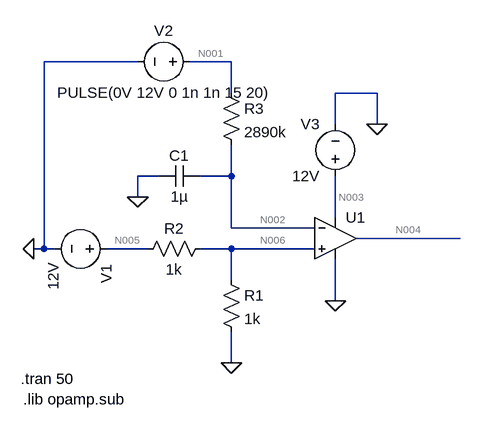
[diagram p0: schematic Timer.asc]
Timer.asc, the LTspice schematic file:
Version 4
SHEET 1 880 680
WIRE 160 -208 16 -208
WIRE 304 -208 240 -208
WIRE 304 -160 304 -208
WIRE 528 -160 464 -160
WIRE 464 -112 464 -160
WIRE 528 -112 528 -160
WIRE 192 -32 160 -32
WIRE 304 -32 304 -80
WIRE 304 -32 256 -32
WIRE 160 0 160 -32
WIRE 464 32 464 -32
WIRE 304 48 304 -32
WIRE 432 48 304 48
WIRE 656 64 496 64
WIRE 16 80 16 -208
WIRE 16 80 0 80
WIRE 32 80 16 80
WIRE 176 80 112 80
WIRE 304 80 256 80
WIRE 432 80 304 80
WIRE 304 128 304 80
WIRE 464 160 464 96
WIRE 304 256 304 208
FLAG 0 80 0
FLAG 304 256 0
FLAG 160 0 0
FLAG 464 160 0
FLAG 528 -112 0
SYMBOL voltage 128 80 R90
WINDOW 3 21 98 Left 2
WINDOW 123 0 0 Left 0
WINDOW 39 0 0 Left 0
SYMATTR InstName V1
SYMATTR Value 12V
SYMBOL res 288 112 R0
SYMATTR InstName R1
SYMATTR Value 1k
SYMBOL res 272 64 R90
WINDOW 0 0 56 VBottom 2
WINDOW 3 32 56 VTop 2
SYMATTR InstName R2
SYMATTR Value 1k
SYMBOL cap 256 -48 R90
WINDOW 0 0 32 VBottom 2
WINDOW 3 32 32 VTop 2
SYMATTR InstName C1
SYMATTR Value 1µ
SYMBOL res 288 -176 R0
SYMATTR InstName R3
SYMATTR Value 2890k
SYMBOL voltage 256 -208 R90
WINDOW 0 -32 56 VBottom 2
WINDOW 3 32 56 VTop 2
WINDOW 123 0 0 Left 0
WINDOW 39 0 0 Left 0
SYMATTR InstName V2
SYMATTR Value PULSE(0V 12V 0 1n 1n 15 20)
SYMBOL voltage 464 -16 R180
WINDOW 0 24 96 Left 2
WINDOW 3 24 16 Left 2
WINDOW 123 0 0 Left 0
WINDOW 39 0 0 Left 0
SYMATTR InstName V3
SYMATTR Value 12V
SYMBOL Opamps\\UniversalOpamp2 464 64 R0
SYMATTR InstName U1
TEXT -20 280 Left 2 !.tran 50
TEXT -16 312 Left 2 !.lib opamp.sub

The netlist it stands for:
* Timer.asc
V1 N005 0 12V
R1 N006 0 1k
R2 N006 N005 1k
C1 N002 0 1µ
R3 N001 N002 2890k
V2 N001 0 PULSE(0V 12V 0 1n 1n 15 20)
V3 N003 0 12V
XU1 N006 N002 N003 0 N004 level.2 Avol=1Meg GBW=10Meg Slew=10Meg ilimit=25m rail=0 Vos=0 phimargin=45 en=0 enk=0 in=0 ink=0 Rin=500Meg  ; pins IN+ IN- V+ V- OUT
.tran 50
.lib opamp.sub
.lib UniversalOpamps2.sub
.backanno
.end

* Results of the author's LTspice run, read from the files saved beside the schematic
* Operating Point, zero values left out:
*   V(n005) = 12 V
*   V(n006) = 6 V
*   V(n002) = 34.48 mV
*   V(n003) = 12 V
*   V(n004) = 12 V
*   I(R3) = -11.93 nA
*   I(R2) = -6 mA
*   I(R1) = 6 mA
*   I(V3) = -1.303 µA
*   I(V2) = 11.93 nA
*   I(V1) = -6 mA
*   Ix(u1:2) = -11.93 nA
*   Ix(u1:3) = 1.303 µA
*   Ix(u1:4) = -1.401 µA
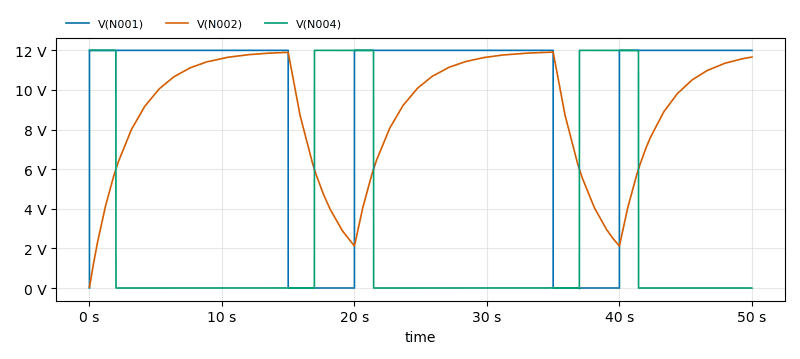
[diagram p1: Transient Analysis of Timer.asc, plotted from the saved traces]
* Transient Analysis, 1 run:
*   V(N001): min 0 V, max 12 V, average 9.6 V, rms 10.73 V, last 12 V
*   V(N002): min 34.48 mV, max 11.91 V, average 8.905 V, rms 9.45 V, last 11.66 V
*   V(N004): min -39.18 mV, max 12 V, average 2.62 V, rms 5.607 V, last 14.31 µV